# Altium schematic sheet CON_PCPPORT_26WBOXHDRRAM.SchDoc: PC Parallel Port + 1-Wire
size A4; Organization: Altium Limited.; Address1: Level 3, 12a Rodborough Rd; Address2: Frenchs Forest 2086; Address3: NSW; Address4: AUSTRALIA; Revision: 6; SheetNumber: 47; SheetTotal: 64
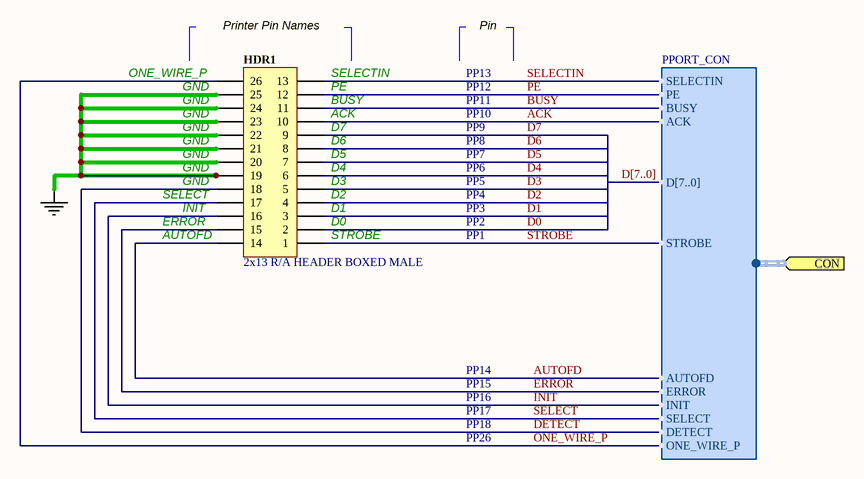
[diagram p0: CON_PCPPORT_26WBOXHDRRAM.SchDoc]

## Parts
HDR1  2x13 R/A HEADER BOXED MALE  [HDR2X13_RA_CENTRONICS]

## Ports
CON (harness PPORT_CON)

## Harnesses
PPORT_CON: SELECTIN, PE, BUSY, ACK, STROBE, AUTOFD, ERROR, INIT, SELECT, DETECT, ONE_WIRE_P, D[7..0]

## Nets
GND: HDR1.19 HDR1.20 HDR1.21 HDR1.22 HDR1.23 HDR1.24 HDR1.25
ACK: HDR1.10 ; port CON.ACK
AUTOFD: HDR1.14 ; port CON.AUTOFD
BUSY: HDR1.11 ; port CON.BUSY
D0: HDR1.2
D1: HDR1.3
D2: HDR1.4
D3: HDR1.5
D4: HDR1.6
D5: HDR1.7
D6: HDR1.8
D7: HDR1.9
DETECT: HDR1.18 ; port CON.DETECT
ERROR: HDR1.15 ; port CON.ERROR
INIT: HDR1.16 ; port CON.INIT
ONE_WIRE_P: HDR1.26 ; port CON.ONE_WIRE_P
PE: HDR1.12 ; port CON.PE
SELECT: HDR1.17 ; port CON.SELECT
SELECTIN: HDR1.13 ; port CON.SELECTIN
STROBE: HDR1.1 ; port CON.STROBE

## Buses and harness runs
bus D[7..0]

## Notes on the sheet
- ONE_WIRE_P
- (near HDR1) Printer Pin Names
- (near HDR1) SELECTIN
- PP13
- Pin
- (near HDR1) GND
- (near HDR1) PE
- (near HDR1) BUSY
- (near HDR1) ACK
- (near HDR1) D5
- (near HDR1) D6
- (near HDR1) D7
- PP12
- PP11
- PP10
- PP9
- PP7
- PP8
- (near HDR1) SELECT
- (near HDR1) INIT
- (near HDR1) D1
- (near HDR1) D2
- (near HDR1) D3
- (near HDR1) D4
- PP3
- PP4
- PP6
- PP5
- (near HDR1) AUTOFD
- (near HDR1) ERROR
- (near HDR1) STROBE
- (near HDR1) D0
- PP1
- PP2
- PP14
- PP15
- PP16
- PP17
- PP18
- PP26
- Sheet Title
- Project Title
- Size:
- Date:
- A4
- Assy:
- Time:
- Sheet
- Revision:
- of
- File:

## Library data of the parts
HDR1 = D-300-0015: Header IDC, 2 x 13 Pin Right-Angle 2.54mm Pitch (Boxed-Male); Max Current: 3 A; Category: Connector; Connector type: Header; Mounting Technology: Through-Hole; Pin Count: 26; Status: Production